# EAGLE design Adapter (EAGLE 9.6.2)
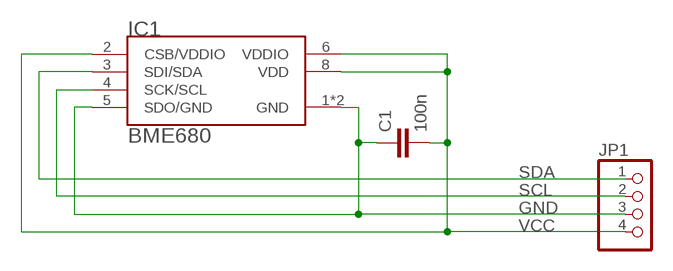
[diagram p0: schematic, sheet 1]

## Parts
C1  100n  C-EUC0805  [C0805]
IC1  BME680  [LGA8]
JP1  PINHD-1X4  [1X04]

## Nets
GND: C1.1 IC1.1(GND) IC1.5(SDO/GND) IC1.7(GND) JP1.3
SCL: IC1.4(SCK/SCL) JP1.2
SDA: IC1.3(SDI/SDA) JP1.1
VCC: C1.2 IC1.2(CSB/VDDIO) IC1.6(VDDIO) IC1.8(VDD) JP1.4

## Library data of the parts
C1 = rcl:C-EU: CAPACITOR, European symbol; SPICEPREFIX: C
IC1 = Tjarks_Bauteile (1):BME680
JP1 = pinhead:PINHD-1X4: PIN HEADER

## Board
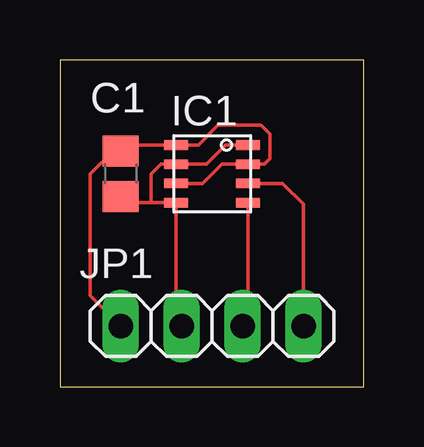
[diagram p1: board, top side]

Size 12.68 x 13.64 mm. Coordinates in mm from the lower left corner, seen from the top.
Outline: 0,0 12.68,0 12.68,13.64 0,13.64 0,0
Copper layers (1*16): Top 0.035mm / dielectric 1.5mm / Bottom 0.035mm
Design rules "JLCPCB *": minimum track width 5mil, minimum drill 0.2mm, track to track 5mil, track to pad 0.2mm, pad to pad 5mil, via to via 10mil, smd to smd 5mil, copper to edge 0.2mm, drill to drill 0.5mm, minimum pad ring 0.13mm, minimum via ring 0.225mm, stop-mask expansion 0.05mm, vias tented up to drill 0mil, thermal gap 10mil

### Footprints (pad centres in the part's own frame; a part is rotated, then mirrored left to right if it is on the bottom)
C0805 = smd 1.3 x 1.5: 1 -0.95,0; 2 0.95,0
LGA8 = smd 1 x 0.4: 1 1.5,1.2; 2 1.5,0.4; 3 1.5,-0.4; 4 1.5,-1.2; 5 -1.5,-1.2; 6 -1.5,-0.4; 7 -1.5,0.4; 8 -1.5,1.2
1X04 = drill 1.016 long: 1 -3.81,0; 2 -1.27,0; 3 1.27,0; 4 3.81,0

### Placement (x,y rotation side)
C1  2.54,8.89 90 top
IC1  6.35,8.89 0 top
JP1  6.35,2.54 180 top

### Tracks (layer width: path | path; a pad name or v marks a point on that pad's centre or on a via)
GND
  Top 0.152: C1.1 2.79,7.69 3.81,7.69 | 3.81,7.69 IC1.5 4.85,2.77 JP1.3 | 3.81,7.69 3.81,8.89 4.21,9.29 IC1.7 6.12,9.29 6.92,10.09 IC1.1
SCL
  Top 0.152: IC1.4 7.85,2.77 JP1.2
SDA
  Top 0.152: JP1.1 10.16,7.62 9.29,8.49 IC1.3
VCC
  Top 0.152: JP1.4 1.27,3.81 1.27,8.89 2.22,9.84 C1.2 2.79,10.09 IC1.8 5.77,10.09 6.6,10.92 8.38,10.92 8.76,10.54 8.76,9.53 8.53,9.29 IC1.2 6.75,9.29 5.95,8.49 IC1.6